# EAGLE schematic didah (EAGLE 6.4)
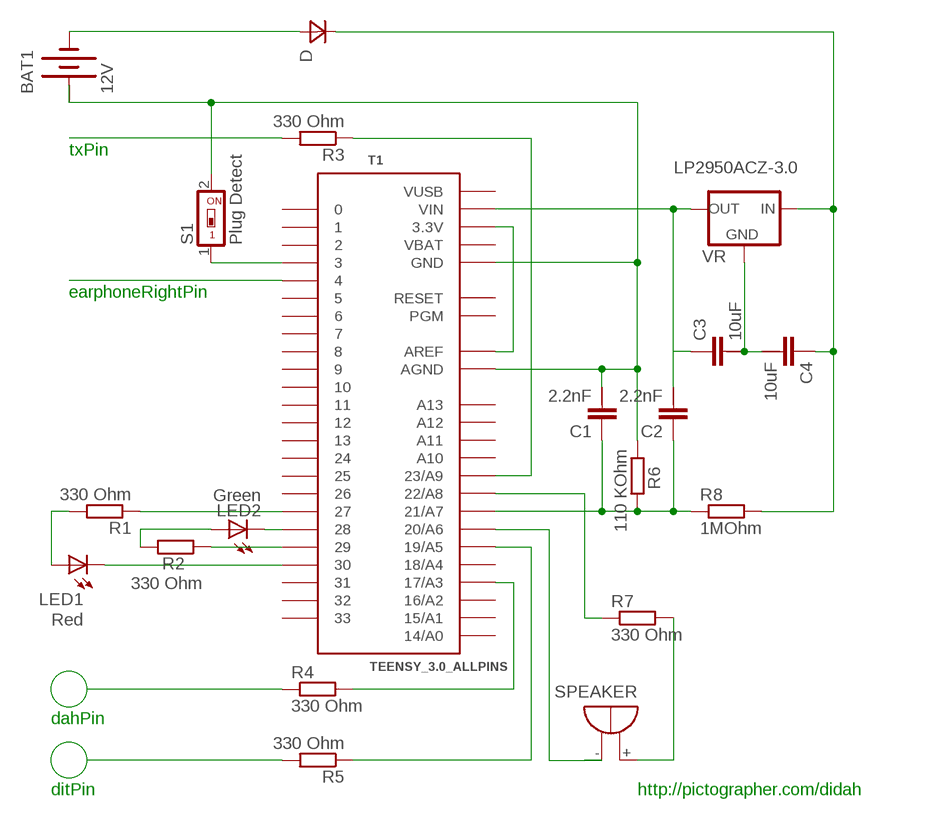
[diagram p0: schematic, sheet 1]

## Parts
BAT1  12V  BATTERY  [BATTERY]
C1  2.2nF  C-2.5-5/6  [C2.5/5-6]
C2  2.2nF  C-2.5-5/6  [C2.5/5-6]
C3  10uF  C-2.5-5/6  [C2.5/5-6]
C4  10uF  C-2.5-5/6  [C2.5/5-6]
D  DIODE  [DIODE]
LED1  Red  LED_ESML0603  [LED_SML0603]
LED2  Green  LED_ESML0603  [LED_SML0603]
R1  330 Ohm  RR0402  [R0402]
R2  330 Ohm  RR0402  [R0402]
R3  330 Ohm  RR0402  [R0402]
R4  330 Ohm  RR0402  [R0402]
R5  330 Ohm  RR0402  [R0402]
R6  110 KOhm  R0204/7  [0204/7]
R7  330 Ohm  RR0402  [R0402]
R8  1MOhm  R0204/7  [0204/7]
S1  Plug Detect  SWS001  [SMS-001]
SPEAKER  BMT1205XH7.5  [BMT1205XH7.5]
T1  TEENSY_3.0_ALLPINS  [TEENSY_3.0_ALLPINS]
VR  LP2950ACZ-3.0  [TO92]

## Nets
N$1: R1.1 T1.27
N$2: LED2.A R2.2
N$3: C2.2 C3.1 T1.VIN VR.1(OUT)
N$4: BAT1.- D.C
N$5: LED1.C T1.30
N$6: LED1.A R1.2
N$7: LED2.C T1.28
N$8: R2.1 T1.29
N$9: C4.1 D.A R8.2 VR.3(IN)
N$10: C3.2 C4.2 VR.2(GND)
N$11: C1.1 C2.1 R6.2 R8.1 T1.21/A7
N$12: BAT1.+ BAT1.+@1(+) C1.2 R6.1 S1.2 T1.AGND T1.GND T1.GND1(GND) T1.GND2(GND)
N$13: R7.2 SPEAKER.+
N$14: T1.3.3V T1.3.3V1(3.3V) T1.3.3V2(3.3V) T1.AREF
N$15: SPEAKER.- T1.20/A6
N$16: R7.1 T1.22/A8
N$17: R5.2
N$18: R4.1
N$19: R3.1 T1.23/A9
N$20: R3.2
N$21: T1.4
N$22: R4.2 T1.17/A3
N$23: R5.1 T1.19/A5
N$24: S1.1 T1.3
Unconnected: C1.3 C2.3 C3.3 C4.3 T1.0 T1.1 T1.2 T1.5 T1.6 T1.7 T1.8 T1.9 T1.10 T1.11 T1.12 T1.13 T1.14/A0 T1.15/A1 T1.16/A2 T1.18/A4 T1.24 T1.25 T1.26 T1.31 T1.32 T1.33 T1.A10 T1.A11 T1.A12 T1.A13 T1.PGM T1.RESET

## Notes on the sheet
- txPin
- earphoneRightPin
- dahPin
- ditPin | http://pictographer.com/didah

## Power pins joined to a net without a drawn wire
VBAT: T1.VBAT
VUSB: T1.VUSB

## Library data of the parts
BAT1 = special:BATTERY: BATTERY
C1-C4 = capacitor-wima:C-: CAPACITOR for alternative placement naming: default grid - extended grid/package width
D = e-halbleiter:DIODE: Diode
LED1 LED2 = eagle-ltspice:LED_E: LED Source: http://www.osram.convergy.de Source: www.luxeon.com Source: www.kingbright.com; SPICEMODEL: NONE; SPICEPREFIX: D; SPICETYPE: diode
R1-R8 = eagle-ltspice:R: RESISTOR, European symbol; SPICEMODEL: NONE; SPICEPREFIX: R
S1 = smd-special:SWS001: SMD Dip Switch 1 pol.
SPEAKER = buzzer:BMT1205XH7.5: MAGNETIC TRANSDUCER Source: Http:www.be-star.com; OC_FARNELL: unknown; OC_NEWARK: unknown
T1 = Teensy3.0:TEENSY_3.0_ALLPINS: Teensy 3.0 with all pin holes and optional SMD-mount unshrouded header on bottom of Teensy 3.0. For more basic versions, see 'Basic', '+4' and 'AllAnalogPins'. Requires the installation of a un-shrouded SMD header on the underside of the Teensy 3.0
VR = v-reg:LP2950?*: Source: http://cache.national.com/ds/LP/LP2950.pdf